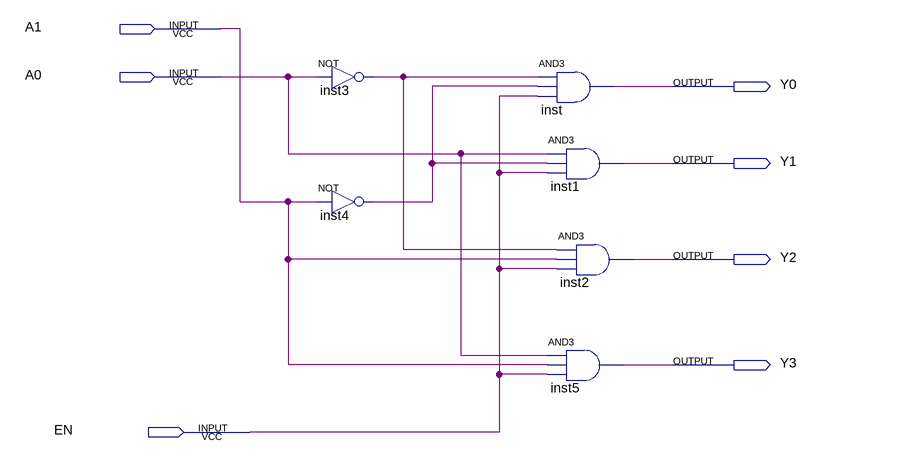
[diagram p0: schematic sheet]
// Quartus schematic decoder2to4.bdf as structural Verilog: 6 symbols, 7 pins
module decoder2to4 (
  input  A1,
  input  A0,
  input  EN,
  output Y0,
  output Y1,
  output Y2,
  output Y3
);

  wire inst3_out, inst4_out;

  not inst3 (inst3_out, A0);
  not inst4 (inst4_out, A1);
  and inst (Y0, inst3_out, inst4_out, EN);
  and inst1 (Y1, A0, inst4_out, EN);
  and inst2 (Y2, inst3_out, A1, EN);
  and inst5 (Y3, A0, A1, EN);
endmodule
